# Altium schematic sheet Top_Sheet.SchDoc
size A; SheetNumber: 1; SheetTotal: 6
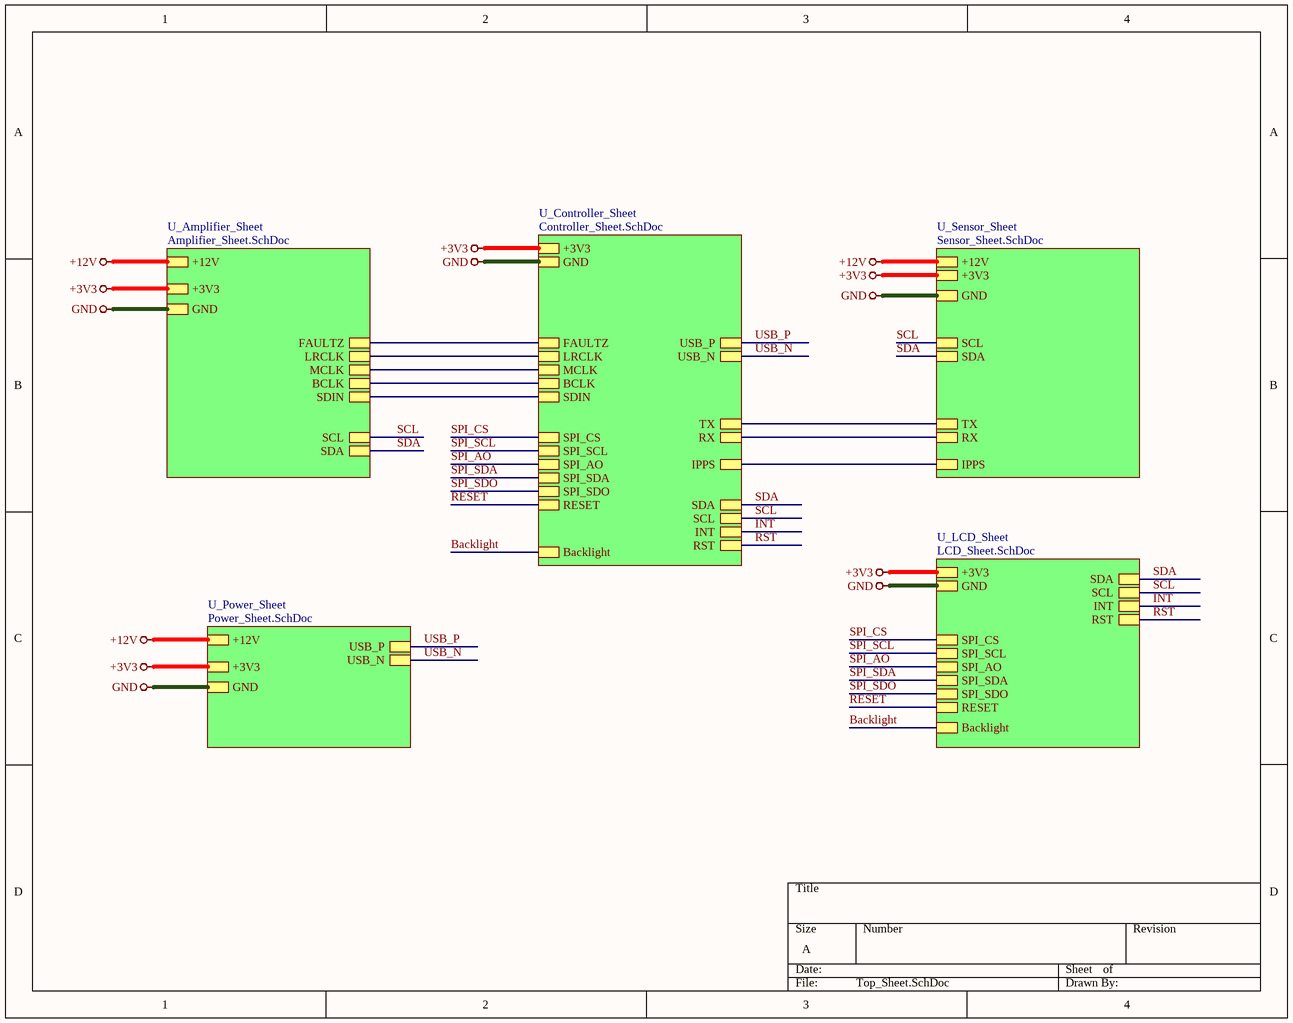
[diagram p0: Top_Sheet.SchDoc]

## Sub-sheets
U_Amplifier_Sheet = Amplifier_Sheet.SchDoc: +12V, +3V3, GND, FAULTZ, LRCLK, MCLK, BCLK, SDIN, SCL, SDA
U_Controller_Sheet = Controller_Sheet.SchDoc: +3V3, GND, FAULTZ, LRCLK, MCLK, BCLK, SDIN, SCL, SDA, TX, RX, IPPS, USB_P, USB_N, SPI_CS, SPI_SCL, SPI_AO, SPI_SDA, SPI_SDO, RESET, Backlight, INT, RST
U_LCD_Sheet = LCD_Sheet.SchDoc: +3V3, GND, SPI_CS, SPI_SCL, SPI_AO, SPI_SDA, SPI_SDO, RESET, Backlight, SDA, SCL, INT, RST
U_Power_Sheet = Power_Sheet.SchDoc: +12V, GND, USB_P, USB_N, +3V3
U_Sensor_Sheet = Sensor_Sheet.SchDoc: +12V, +3V3, GND, SCL, SDA, TX, RX, IPPS

## Nets
+3V3: sheet U_Amplifier_Sheet/+3V3, sheet U_Power_Sheet/+3V3, sheet U_Sensor_Sheet/+3V3, sheet U_LCD_Sheet/+3V3, sheet U_Controller_Sheet/+3V3
+12V: sheet U_Amplifier_Sheet/+12V, sheet U_Power_Sheet/+12V, sheet U_Sensor_Sheet/+12V
GND: sheet U_Amplifier_Sheet/GND, sheet U_Power_Sheet/GND, sheet U_Sensor_Sheet/GND, sheet U_LCD_Sheet/GND, sheet U_Controller_Sheet/GND
Backlight: sheet U_LCD_Sheet/Backlight, sheet U_Controller_Sheet/Backlight
INT: sheet U_LCD_Sheet/INT, sheet U_Controller_Sheet/INT
RESET: sheet U_LCD_Sheet/RESET, sheet U_Controller_Sheet/RESET
RST: sheet U_LCD_Sheet/RST, sheet U_Controller_Sheet/RST
SCL: sheet U_Amplifier_Sheet/SCL, sheet U_Sensor_Sheet/SCL, sheet U_LCD_Sheet/SCL, sheet U_Controller_Sheet/SCL
SDA: sheet U_Amplifier_Sheet/SDA, sheet U_Sensor_Sheet/SDA, sheet U_LCD_Sheet/SDA, sheet U_Controller_Sheet/SDA
SPI_AO: sheet U_LCD_Sheet/SPI_AO, sheet U_Controller_Sheet/SPI_AO
SPI_CS: sheet U_LCD_Sheet/SPI_CS, sheet U_Controller_Sheet/SPI_CS
SPI_SCL: sheet U_LCD_Sheet/SPI_SCL, sheet U_Controller_Sheet/SPI_SCL
SPI_SDA: sheet U_LCD_Sheet/SPI_SDA, sheet U_Controller_Sheet/SPI_SDA
SPI_SDO: sheet U_LCD_Sheet/SPI_SDO, sheet U_Controller_Sheet/SPI_SDO
USB_N: sheet U_Power_Sheet/USB_N, sheet U_Controller_Sheet/USB_N
USB_P: sheet U_Power_Sheet/USB_P, sheet U_Controller_Sheet/USB_P
(unnamed): sheet U_Amplifier_Sheet/FAULTZ, sheet U_Controller_Sheet/FAULTZ
(unnamed): sheet U_Amplifier_Sheet/LRCLK, sheet U_Controller_Sheet/LRCLK
(unnamed): sheet U_Amplifier_Sheet/MCLK, sheet U_Controller_Sheet/MCLK
(unnamed): sheet U_Amplifier_Sheet/BCLK, sheet U_Controller_Sheet/BCLK
(unnamed): sheet U_Amplifier_Sheet/SDIN, sheet U_Controller_Sheet/SDIN
(unnamed): sheet U_Sensor_Sheet/TX, sheet U_Controller_Sheet/TX
(unnamed): sheet U_Sensor_Sheet/RX, sheet U_Controller_Sheet/RX
(unnamed): sheet U_Sensor_Sheet/IPPS, sheet U_Controller_Sheet/IPPS